# EAGLE design Controller PCB (EAGLE 9.6.2)
DESCRIPTION: microOBD 200 OBD-II Module; HW_REV: 1.4; PCB_REV: C; PCB_SPEC1: Layer Count: 4; PCB_SPEC2: Size: 1.3" x 0.59"; PCB_SPEC3: Finish Thickness: 0.049" - 0.052"; PCB_SPEC4: Copper Weight: 1oz; TITLE: STM1120
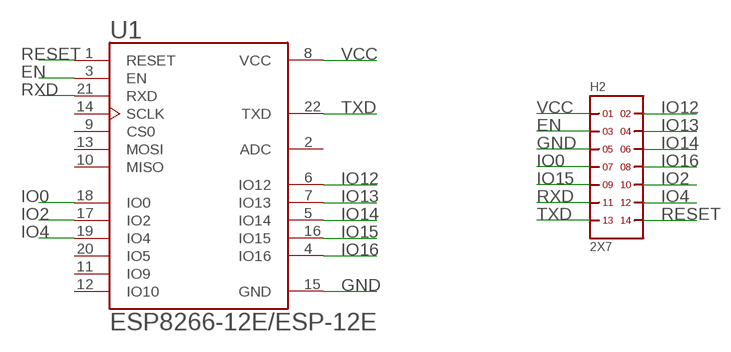
[diagram p0: schematic, sheet 1]

## Parts
H2  2X7  [2X7]
U1  ESP8266-12E/ESP-12E  [XCVR_ESP8266-12E/ESP-12E]

## Nets
EN: H2.3 U1.3(EN)
GND: H2.5 U1.15(GND)
IO0: H2.7 U1.18(IO0)
IO2: H2.10 U1.17(IO2)
IO4: H2.12 U1.19(IO4)
IO12: H2.2 U1.6(IO12)
IO13: H2.4 U1.7(IO13)
IO14: H2.6 U1.5(IO14)
IO15: H2.9 U1.16(IO15)
IO16: H2.8 U1.4(IO16)
RESET: H2.14 U1.1(RESET)
RXD: H2.11 U1.21(RXD)
TXD: H2.13 U1.22(TXD)
VCC: H2.1 U1.8(VCC)
Unconnected: U1.2(ADC) U1.9(CS0) U1.10(MISO) U1.11(IO9) U1.12(IO10) U1.13(MOSI) U1.14(SCLK) U1.20(IO5)

## Library data of the parts
H2 = headers(.1in):2X7
U1 = ESP8266-12E_ESP-12E:ESP8266-12E/ESP-12E: ESP-12E WiFi Module Check availability <https://pricing.snapeda.com/parts/ESP8266-12E/ESP-12E/AI-Thinker/view-part?ref=eda>; AVAILABILITY: Not in stock; DESCRIPTION: This WiFi module has a 32-bit MCU micro and clock speeds supporting 80 MHz or 160 MHz. Supports the RTOS and integrated Wi-Fi MAC/BB/RF/PA/LNA, and has an on-board antenna.; MF: AI-Thinker; MP: ESP8266-12E/ESP-12E; PACKAGE: None; PRICE: None

## Board
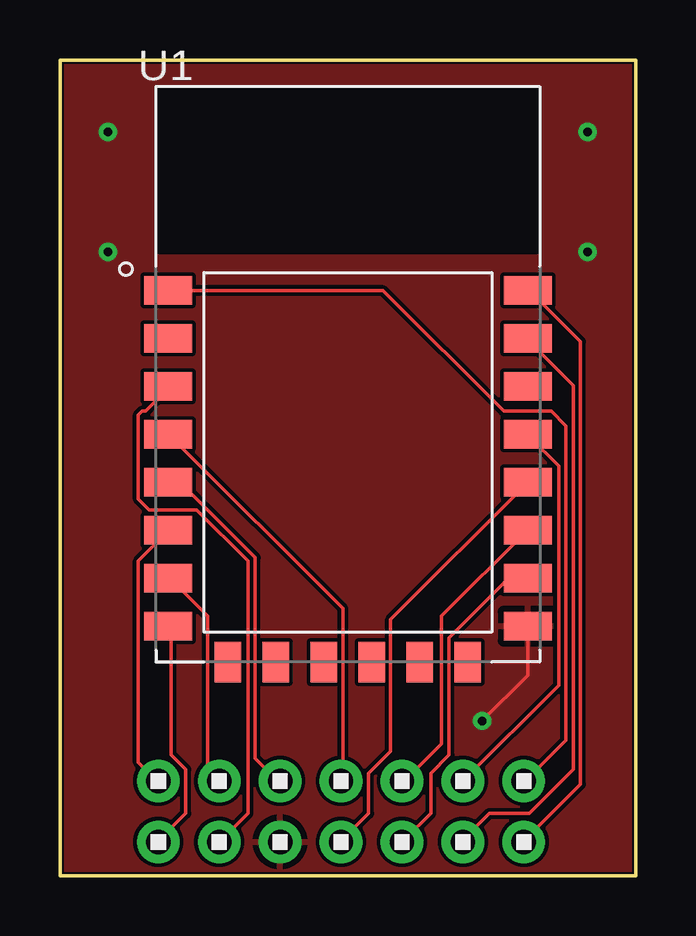
[diagram p1: board, top side]
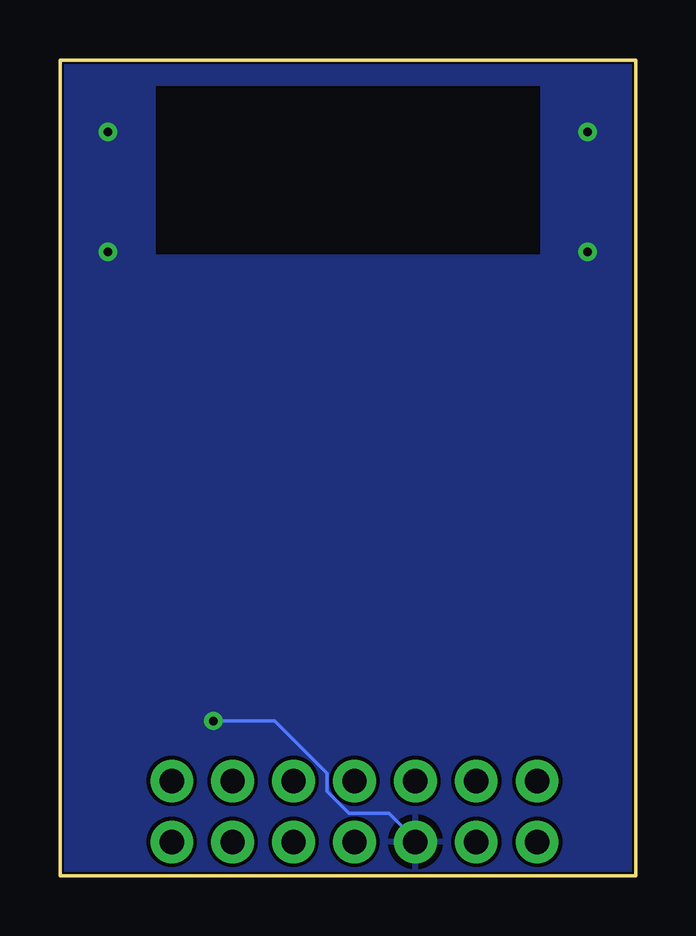
[diagram p2: board, bottom side, seen from below]

Size 24 x 34 mm. Coordinates in mm from the lower left corner, seen from the top.
Outline: 0,0 24,0 24,34 0,34 0,0
Copper layers (1*16): Top 0.035mm / dielectric 1.5mm / Bottom 0.035mm
Design rules "default *": minimum track width 6mil, minimum drill 0.35mm, track to track 6mil, track to pad 6mil, pad to pad 6mil, via to via 6mil, smd to smd 6mil, copper to edge 6mil, drill to drill 6mil, minimum pad ring 10mil, minimum via ring 8mil, stop-mask expansion 4mil, vias tented up to drill 0mil, thermal gap 10mil
Milling: 4 lines

### Footprints (pad centres in the part's own frame; a part is rotated, then mirrored left to right if it is on the bottom)
2X7 = drill 1.016 pad 1.778: 1 0,0; 2 0,2.54; 3 2.54,0; 4 2.54,2.54; 5 5.08,0; 6 5.08,2.54; 7 7.62,0; 8 7.62,2.54; 9 10.16,0; 10 10.16,2.54; 11 12.7,0; 12 12.7,2.54; 13 15.24,0; 14 15.24,2.54
XCVR_ESP8266-12E/ESP-12E = smd 2 x 1.2: 1 -7.5,7; 2 -7.5,5; 3 -7.5,3; 4 -7.5,1; 5 -7.5,-1; 6 -7.5,-3; 7 -7.5,-5; 8 -7.5,-7; 15 7.5,-7; 16 7.5,-5; 17 7.5,-3; 18 7.5,-1; 19 7.5,1; 20 7.5,3; 21 7.5,5; 22 7.5,7 | smd 1.1 x 1.7: 9 -5,-8.5; 10 -3,-8.5; 11 -1,-8.5; 12 1,-8.5; 13 3,-8.5; 14 5,-8.5

### Placement (x,y rotation side)
H2  4.1,1.4 0 top
U1  12,17.4 0 top

### Tracks (layer width: path | path; a pad name or v marks a point on that pad's centre or on a via)
EN
  Top 0.152: U1.3 4.49,20.27 3.57,19.36 3.42,19.36 3.27,19.2 3.27,15.7 3.72,15.24 5.71,15.24 7.84,13.11 7.84,2.59 6.77,1.52 H2.3
GND  (via drill 0.35)
  Top 0.152: U1.15 19.5,8.34 v17.6,6.44
  Bottom 0.152: v17.6,6.44 15.05,6.44 12.87,4.27 12.87,3.5 11.95,2.59 10.28,2.59 9.21,1.52 H2.5
  other vias: 2,31 2,26 22,31 22,26
  pour Top: -1.3,35.2 25.7,35.2 26,34.9 26,-0.4 24.2,-2.2 -0.6,-2.2 -1.2,-1.6 -1.3,-1.5
  pour Bottom: -1.1,36 24.8,36 26.5,34.3 26.5,0.7 23.8,-2 23.6,-2.2 -1.6,-2.2 -1.6,35.4 -1.1,35.9
IO0
  Top 0.152: U1.18 19.42,16.31 13.78,10.67 13.78,5.18 12.87,4.27 12.87,2.59 11.8,1.52 H2.7
IO2
  Top 0.152: U1.17 19.42,14.33 15.92,10.82 15.92,5.49 14.39,3.96 H2.10
IO4
  Top 0.152: U1.19 19.57,18.29 20.79,17.07 20.79,7.92 16.83,3.96 H2.12
IO12
  Top 0.152: U1.6 4.49,14.33 3.27,13.11 3.27,4.72 4.03,3.96 H2.2
IO13
  Top 0.152: U1.7 4.64,12.34 6.16,10.82 6.16,4.42 6.62,3.96 H2.4
IO14
  Top 0.152: U1.5 4.64,16.31 5.1,16.31 8.14,13.26 8.14,4.88 9.06,3.96 H2.6
IO15
  Top 0.152: U1.16 19.42,12.34 18.66,12.34 16.22,9.91 16.22,5.03 15.46,4.27 15.46,2.59 14.39,1.52 H2.9
IO16
  Top 0.152: U1.4 4.64,18.29 11.8,11.12 11.8,3.96 H2.8
RESET
  Top 0.152: U1.1 4.64,24.38 13.48,24.38 18.51,19.36 20.49,19.36 21.1,18.75 21.1,5.64 19.42,3.96 H2.14
RXD
  Top 0.152: U1.21 19.57,22.25 21.4,20.42 21.4,4.42 19.57,2.59 17.9,2.59 16.83,1.52 H2.11
TXD
  Top 0.152: U1.22 19.57,24.38 21.71,22.25 21.71,3.81 19.42,1.52 H2.13
VCC
  Top 0.152: U1.8 4.64,10.36 4.64,5.03 5.25,4.42 5.25,2.59 4.18,1.52 H2.1